# Altium project Ver2.PrjPcb
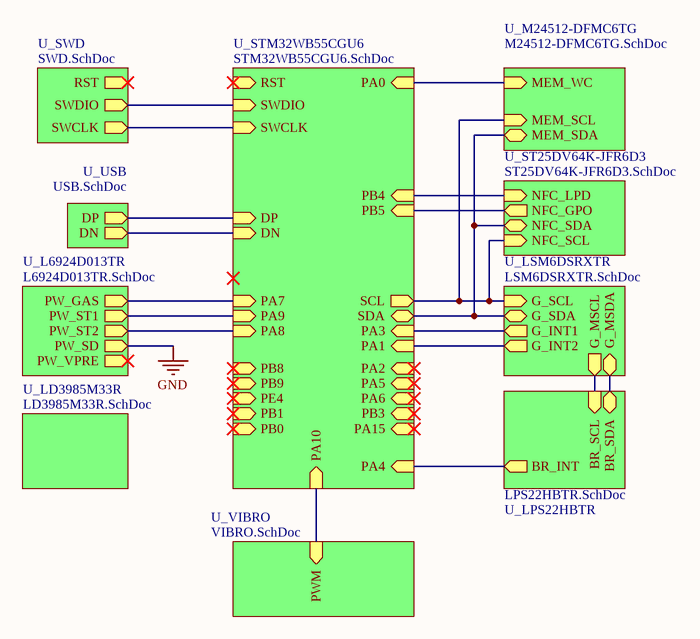
[diagram p0: Device.SchDoc]
2 sheets, 29 parts. Net scope: hierarchical (ports join the sheet entries above them; power ports are global).
Board file: PCB.PcbDoc
Sheets:
  Device.SchDoc
    U_STM32WB55CGU6 = STM32WB55CGU6.SchDoc

## Sheet Device.SchDoc
size A4; SheetNumber: 1; SheetTotal: 11

### Sub-sheets
U_L6924D013TR = L6924D013TR.SchDoc (file not in this document): PW_GAS (out), PW_ST1 (out), PW_ST2 (out), PW_SD (out), PW_VPRE (out)
U_LD3985M33R = LD3985M33R.SchDoc (file not in this document): no entries
U_LPS22HBTR = LPS22HBTR.SchDoc (file not in this document): BR_SCL (in), BR_SDA (bidir), BR_INT (out)
U_LSM6DSRXTR = LSM6DSRXTR.SchDoc (file not in this document): G_MSCL (out), G_MSDA (bidir), G_SCL (in), G_SDA (bidir), G_INT1 (out), G_INT2 (out)
U_M24512-DFMC6TG = M24512-DFMC6TG.SchDoc (file not in this document): MEM_SDA (bidir), MEM_SCL (in), MEM_WC (in)
U_ST25DV64K-JFR6D3 = ST25DV64K-JFR6D3.SchDoc (file not in this document): NFC_SCL (in), NFC_SDA (bidir), NFC_GPO (out), NFC_LPD (in)
U_STM32WB55CGU6 = STM32WB55CGU6.SchDoc: SCL (out), SDA (bidir), DP (in), DN (in), RST (in), SWDIO (in), SWCLK (in), PA0 (in), PA1 (in), PA15 (in), PA7 (in), PB4 (in), PB3 (in), PA4 (in), PA5 (in), PA10 (in), PA6 (in), PA2 (in), PA3 (in), PB8 (in), PB9 (in), PB5 (in), PE4 (in), PB1 (in), PB0 (in), PA8 (in), PA9 (in)
U_SWD = SWD.SchDoc (file not in this document): RST (out), SWDIO (out), SWCLK (out)
U_USB = USB.SchDoc (file not in this document): DP (out), DN (out)
U_VIBRO = VIBRO.SchDoc (file not in this document): PWM (in)

### Nets
NetR15_1: sheet U_ST25DV64K-JFR6D3/NFC_SCL, sheet U_M24512-DFMC6TG/MEM_SCL, sheet U_LSM6DSRXTR/G_SCL, sheet U_STM32WB55CGU6/SCL
NetR16_1: sheet U_ST25DV64K-JFR6D3/NFC_SDA, sheet U_M24512-DFMC6TG/MEM_SDA, sheet U_LSM6DSRXTR/G_SDA, sheet U_STM32WB55CGU6/SDA
NetU7_9: sheet U_M24512-DFMC6TG/MEM_WC, sheet U_STM32WB55CGU6/PA0
NetU7_10: sheet U_LSM6DSRXTR/G_INT2, sheet U_STM32WB55CGU6/PA1
NetU7_12: sheet U_LSM6DSRXTR/G_INT1, sheet U_STM32WB55CGU6/PA3
NetU7_13: sheet U_LPS22HBTR/BR_INT, sheet U_STM32WB55CGU6/PA4
NetU7_16: sheet U_L6924D013TR/PW_GAS, sheet U_STM32WB55CGU6/PA7
NetU7_17: sheet U_L6924D013TR/PW_ST2, sheet U_STM32WB55CGU6/PA8
NetU7_18: sheet U_L6924D013TR/PW_ST1, sheet U_STM32WB55CGU6/PA9
NetU7_36: sheet U_VIBRO/PWM, sheet U_STM32WB55CGU6/PA10
NetU7_37: sheet U_USB/DN, sheet U_STM32WB55CGU6/DN
NetU7_38: sheet U_USB/DP, sheet U_STM32WB55CGU6/DP
NetU7_39: sheet U_SWD/SWDIO, sheet U_STM32WB55CGU6/SWDIO
NetU7_41: sheet U_SWD/SWCLK, sheet U_STM32WB55CGU6/SWCLK
NetU7_44: sheet U_ST25DV64K-JFR6D3/NFC_LPD, sheet U_STM32WB55CGU6/PB4
NetU7_45: sheet U_ST25DV64K-JFR6D3/NFC_GPO, sheet U_STM32WB55CGU6/PB5
(unnamed): sheet U_LSM6DSRXTR/G_MSCL, sheet U_LPS22HBTR/BR_SCL
(unnamed): sheet U_LSM6DSRXTR/G_MSDA, sheet U_LPS22HBTR/BR_SDA

## Sheet STM32WB55CGU6.SchDoc
size A4; SheetNumber: 11; SheetTotal: 11
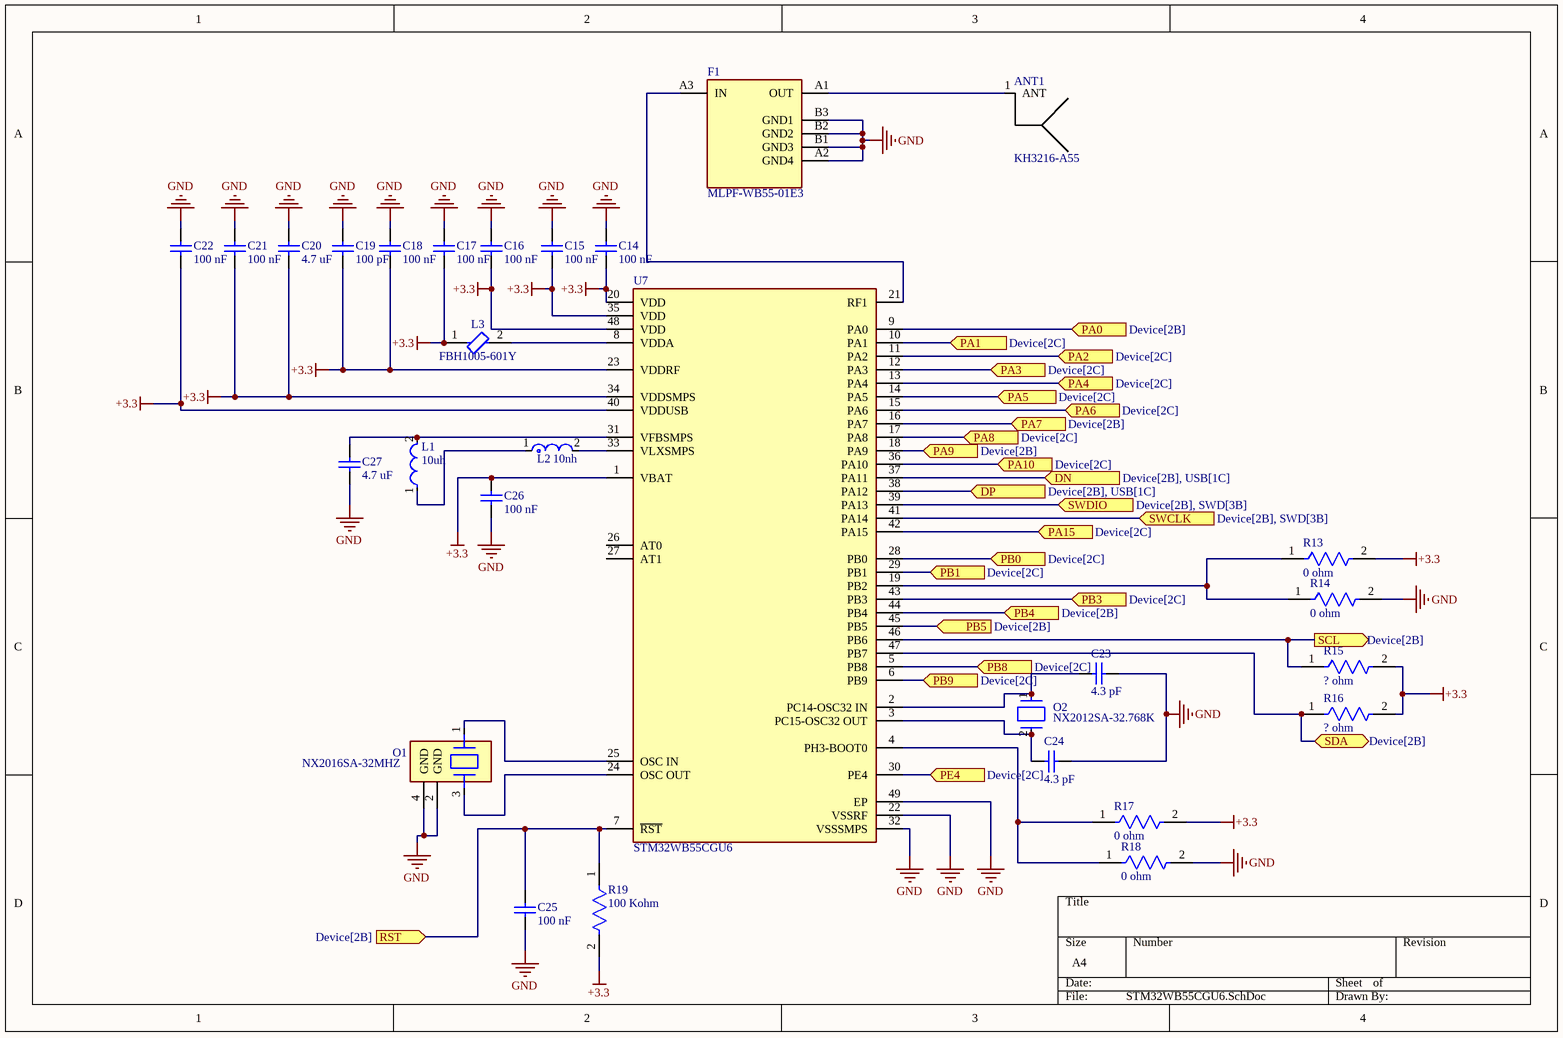
[diagram p1: STM32WB55CGU6.SchDoc]

### Parts
ANT1  KH3216-A55  [KH3216-A55]
C14  100 nF  [CAPC1005X55X25NL05T10]
C15  100 nF  [CAPC1005X55X25NL05T10]
C16  100 nF  [CAPC1005X55X25NL05T10]
C17  100 nF  [CAPC1005X55X25NL05T10]
C18  100 nF  [CAPC1005X55X25NL05T10]
C19  100 pF  [CAPC1005X55X25NL05T10]
C20  4.7 uF  [CAPC1005X55X25NL05T10]
C21  100 nF  [CAPC1005X55X25NL05T10]
C22  100 nF  [CAPC1005X55X25NL05T10]
C23  4.3 pF  [CAPC1005X55X25NL05T10]
C24  4.3 pF  [CAPC1005X55X25NL05T10]
C25  100 nF  [CAPC1005X55X25NL05T10]
C26  100 nF  [CAPC1005X55X25NL05T10]
C27  4.7 uF  [CAPC1005X55X25NL05T10]
F1  MLPF-WB55-01E3  [FP-MLPF-WB55-01E3-MFG]
L1  10uh  [FP-LQM21FN_70-MFG]
L2  10nh  [FP-LQG15WH_02-MFG]
L3  FBH1005-601Y  [FP-BLM15-0_05-MFG]
O1  NX2016SA-32MHZ  [FP-NX2016SA-MFG]
O2  NX2012SA-32.768K  [FP-NX2012SA-MFG]
R13  0 ohm  [FP-RC1005-IPC_C]
R14  0 ohm  [FP-RC1005-IPC_C]
R15  ? ohm  [FP-RC1005-IPC_C]
R16  ? ohm  [FP-RC1005-IPC_C]
R17  0 ohm  [FP-RC1005-IPC_C]
R18  0 ohm  [FP-RC1005-IPC_C]
R19  100 Kohm  [FP-RC1005-IPC_C]
U7  STM32WB55CGU6  [FP-STM32WB55CGU6-MFG]

### Ports
DN (in, see Device[2B], USB[1C]), DP (in, see Device[2B], USB[1C]), PA0 (in, see Device[2B]), PA1 (in, see Device[2C]), PA2 (in, see Device[2C]), PA3 (in, see Device[2C]), PA4 (in, see Device[2C]), PA5 (in, see Device[2C]), PA6 (in, see Device[2C]), PA7 (in, see Device[2B]), PA8 (in, see Device[2C]), PA9 (in, see Device[2B]), PA10 (in, see Device[2C]), PA15 (in, see Device[2C]), PB0 (in, see Device[2C]), PB1 (in, see Device[2C]), PB3 (in, see Device[2C]), PB4 (in, see Device[2B]), PB5 (in, see Device[2B]), PB8 (in, see Device[2C]), PB9 (in, see Device[2C]), PE4 (in, see Device[2C]), RST (in, see Device[2B]), SCL (out, see Device[2B]), SDA (bidir, see Device[2B]), SWCLK (in, see Device[2B], SWD[3B]), SWDIO (in, see Device[2B], SWD[3B])

### Nets
+3.3: C14.1 C15.2 C16.1 C17.2 C18.1 C19.2 C20.2 C21.1 C22.2 C26.2 L3.1 R13.2 R15.2 R16.2 R17.2 R19.2 U7.1(VBAT) U7.20(VDD) U7.23(VDDRF) U7.34(VDDSMPS) U7.35(VDD) U7.40(VDDUSB) U7.48(VDD)
GND: C14.2 C15.1 C16.2 C17.1 C18.2 C19.1 C20.1 C21.2 C22.1 C23.2 C24.1 C25.1 C26.1 C27.2 F1.A2(GND4) F1.B1(GND3) F1.B2(GND2) F1.B3(GND1) O1.2(GND) O1.4(GND) R14.2 R18.2 U7.22(VSSRF) U7.32(VSSSMPS) U7.49(EP)
NetANT1_1: ANT1.1(ANT) F1.A1(OUT)
NetC23_1: C23.1 O2.1 U7.2(PC14-OSC32_IN)
NetC24_2: C24.2 O2.2 U7.3(PC15-OSC32_OUT)
NetC25_2: C25.2 R19.1 U7.7(~{RST}) ; port RST
NetC27_1: C27.1 L1.2 U7.31(VFBSMPS)
NetF1_A3: F1.A3(IN) U7.21(RF1)
NetL1_1: L1.1 L2.1
NetL2_2: L2.2 U7.33(VLXSMPS)
NetL3_2: L3.2 U7.8(VDDA)
NetO1_1: O1.1 U7.25(OSC_IN)
NetO1_3: O1.3 U7.24(OSC_OUT)
NetR13_1: R13.1 R14.1 U7.19(PB2)
NetR15_1: R15.1 U7.46(PB6) ; port SCL
NetR16_1: R16.1 U7.47(PB7) ; port SDA
NetR17_1: R17.1 R18.1 U7.4(PH3-BOOT0)
NetU7_5: U7.5(PB8) ; port PB8
NetU7_6: U7.6(PB9) ; port PB9
NetU7_9: U7.9(PA0) ; port PA0
NetU7_10: U7.10(PA1) ; port PA1
NetU7_11: U7.11(PA2) ; port PA2
NetU7_12: U7.12(PA3) ; port PA3
NetU7_13: U7.13(PA4) ; port PA4
NetU7_14: U7.14(PA5) ; port PA5
NetU7_15: U7.15(PA6) ; port PA6
NetU7_16: U7.16(PA7) ; port PA7
NetU7_17: U7.17(PA8) ; port PA8
NetU7_18: U7.18(PA9) ; port PA9
NetU7_28: U7.28(PB0) ; port PB0
NetU7_29: U7.29(PB1) ; port PB1
NetU7_30: U7.30(PE4) ; port PE4
NetU7_36: U7.36(PA10) ; port PA10
NetU7_37: U7.37(PA11) ; port DN
NetU7_38: U7.38(PA12) ; port DP
NetU7_39: U7.39(PA13) ; port SWDIO
NetU7_41: U7.41(PA14) ; port SWCLK
NetU7_42: U7.42(PA15) ; port PA15
NetU7_43: U7.43(PB3) ; port PB3
NetU7_44: U7.44(PB4) ; port PB4
NetU7_45: U7.45(PB5) ; port PB5

Not connected (* = marked no-connect by the designer): U7 26(AT0) 27(AT1)

### Library data of the parts
C14-C27 = CMP-2008-04515-1: Manufacturer: Murata; Part Number: GRM155F50J684ZE01D
F1 = CMP-12074-000002-1: RF FILTER LOW PASS 2.45GHZ 6SMD
L1 = CMP-2000-06587-2: FIXED IND 10UH 100MA 780MOHM SMD; Shielding: Shielded; Core Material: Ferrite; Self Resonant Frequency: 15MHz; Tolerance: 20%; DC Resistance (DCR): 780mR; Test Frequency: 1MHz; Height: 1.45mm; Package Quantity: 3000; Width: 0.049inch; Inductance: 10uH; Saturation Current: 100mA; Termination: SMD/SMT; Case Code (Metric): 2012; Case/Package: 0805; RoHS Compliant: Yes; Series: LQM21F_70; Max Operating Temperature: 125°C; Lead Free: Lead Free; DC Current: 100mA; Length: 2.2mm; Radiation Hardening: No; Max DC Current: 100mA; Case Code (Imperial): 0805; Packaging: Tape and Reel; Height - Seated (Max): 0.057inch; Rated Current-Max: 100mA; Military Standard: Not; Mount: Surface Mount; Min Operating Temperature: -55°C; Depth: 1.45mm; Current Rating: 100mA
L2 = CMP-06042-005237-1: Multilayer type Inductor for Automotive 10nH ±5% 0.19Ω 500mA 0402; Core Material: Air; Test Frequency: 100MHz; DC Resistance (DCR): 190mR; Shielding: Unshielded; Self Resonant Frequency: 3.3GHz; Min Operating Temperature: -55°C; Tolerance: 5%; Inductance: 10nH; Max Operating Temperature: 125°C; Packaging: Cut Tape; Current Rating: 500mA; Case Code (Metric): 1005; Mount: Surface Mount; Case/Package: 0402; Ratings: AEC-Q200; Case Code (Imperial): 0402
L3 = CMP-0686-00187-4: Chip Ferrite Bead, 0402, 600Ω @ 100MHz, 0.52Ω, 25%, 300mA; DC Resistance-Max: 600mR; Number of Lines: 1; DC Resistance (DCR): 520mR; Shielding: Unshielded; Impedance: 600R; Material: Steel; Frequency: 100MHz; Lead Free: Lead Free; Max DC Current: 300mA; Test Frequency: 100MHz; Depth: 0.55mm; Length: 1mm; Case Code (Imperial): 0402; Packaging: Tape and Reel; Height: 0.5mm; Max Operating Temperature: 125°C; Military Standard: Not; REACH SVHC: No SVHC; Case Code (Metric): 1005; Series: BLM15AG_SN; Core Material: Ferrite; Termination: SMD/SMT; DC Current: 300mA; Package Quantity: 10000; Width: 0.5mm; RoHS Compliant: Yes; Min Operating Temperature: -55°C; Current Rating: 300mA; Case/Package: 0402; Number of Pins: 2; Radiation Hardening: No; Tolerance: 25%; Number of Circuits: 1; Max Current Rating: 300mA
O1 = CMP-200220-000017-1: CRYSTAL 32.0000MHZ 8PF SMD; Frequency: 32MHz; ESR (Equivalent Series Resistance): 60R; Ratings: AEC-Q200; Mount: Surface Mount; Case/Package: SMD/SMT; Packaging: Tape and Reel; Load Capacitance: 8pF; Min Operating Temperature: -40°C; Max Operating Temperature: 125°C
O2 = CMP-200220-000019-1: CRYSTAL 32.7680KHZ 12.5PF SMD; Frequency Tolerance: 20ppm; ESR (Equivalent Series Resistance): 80kR; Frequency: 32.768kHz; Mount: Surface Mount; Packaging: Cut Tape; Min Operating Temperature: -40°C; Max Operating Temperature: 85°C; Case/Package: SMD/SMT; RoHS Compliant: Yes; Length: 0.081inch; Series: NX2012SA; Height: 0.024inch; Width: 0.047inch; Load Capacitance: 12.5pF
R13-R19 = CMP-13261-000953-1: Res Thick Film 0402 1.87kΩ 1% 0.063W ±100ppm/°C Molded SMD T/R; Power Rating: 63mW; Voltage Rating (DC): 50V; Resistance: 1.87kR; Tolerance: 1%; Height: 0.016inch; Length: 1mm; Case Code (Metric): 1005; Width: 0.02inch; Max Power Dissipation: 63mW; Radiation Hardening: No; Features: Moisture Resistant; Temperature Coefficient: 100ppm/°C; Min Operating Temperature: -55°C; Number of Terminations: 2; Max Operating Temperature: 155°C; Case Code (Imperial): 0402; Composition: Thick Film; Depth: 0.5mm; Lead Free: Lead Free; Package Quantity: 1; Case/Package: 0402; Packaging: Tape and Reel; Contact Plating: Tin; Military Standard: Not
U7 = CMP-12105-000013-1: ULTRA-LOW-POWER DUAL CORE ARM CO; Manufacturer: STMicroelectronics; Number Of Cores: 1; Number Of I2C Channels: 2; Interface: I2C,SPI,UART,USART,2-Wire,USB,IrDA,Other; Core Architecture: ARM Cortex-M4; Data Bus Width: 32bits; Memory Size: 1MBytes; Number Of Pwm Channels: 14; Max Supply Voltage: 3.6V; Standoff Height: 0mm; Number Of Timers/Counters: 6; Frequency: 64MHz; Max Junction Temp: +105°C; Number Of I/Os: 30; Min Supply Voltage: 1.71V; Number Of Adc Channels: 13; Ram Size: 256KBytes; Memory Type: FLASH; Octopart: https://octopart.com/stm32wb55cgu6-stmicroelectronics-98750847; Temperature Range High: +105°C; RoHS: TRUE; Number Of Spi Channels: 1; Category: IC; Device Class L1: Integrated Circuits (ICs); Lead Free: Yes; Height: 0.65mm; Number Of A/D Converters: 1; Package: UFQFPN48; Number Of Usb Channels: 1; Number Of Uart Channels: 2; Temperature Range Low: -40°C; Ambient Temperature Range Low: -40°C; Device Class L3: Microcontrollers; Manufacturer Part Number: STM32WB55CGU6; Temperature: -40°C to +105°C; ComponentLink2URL: https://www.st.com/resource/en/datasheet/stm32wb55cg.pdf; Device Class L2: Embedded Processors and Controllers; Digikey Description: ULTRA-LOW-POWER DUAL CORE ARM CO; ComponentLink2Description: Datasheet; Ambient Temperature Range High: +85°C; Automotive: No